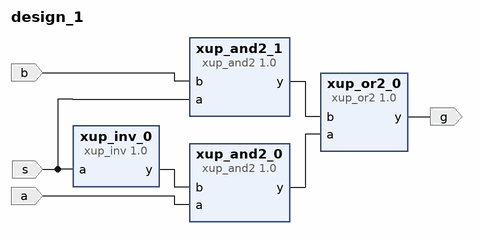
[diagram p0: block diagram of the top level]
# Vivado block design design_1, xc7a35tcpg236-1, Vivado 2019.1
create_bd_design design_1

create_bd_port -dir I s
create_bd_port -dir I a
create_bd_port -dir I b
create_bd_port -dir O g

create_bd_cell -type ip -vlnv xilinx.com:xup:xup_inv:1.0 xup_inv_0
create_bd_cell -type ip -vlnv xilinx.com:xup:xup_and2:1.0 xup_and2_0
create_bd_cell -type ip -vlnv xilinx.com:xup:xup_or2:1.0 xup_or2_0
create_bd_cell -type ip -vlnv xilinx.com:xup:xup_and2:1.0 xup_and2_1

# ---- connections ----

connect_bd_net [get_bd_pins xup_inv_0/y] [get_bd_pins xup_and2_0/b]
connect_bd_net [get_bd_ports s] [get_bd_pins xup_inv_0/a] [get_bd_pins xup_and2_1/a]
connect_bd_net [get_bd_ports a] [get_bd_pins xup_and2_0/a]
connect_bd_net [get_bd_ports b] [get_bd_pins xup_and2_1/b]
connect_bd_net [get_bd_pins xup_and2_0/y] [get_bd_pins xup_or2_0/a]
connect_bd_net [get_bd_pins xup_and2_1/y] [get_bd_pins xup_or2_0/b]
connect_bd_net [get_bd_pins xup_or2_0/y] [get_bd_ports g]

validate_bd_design
save_bd_design
